# EAGLE design powerSupply (EAGLE 7.0.0)
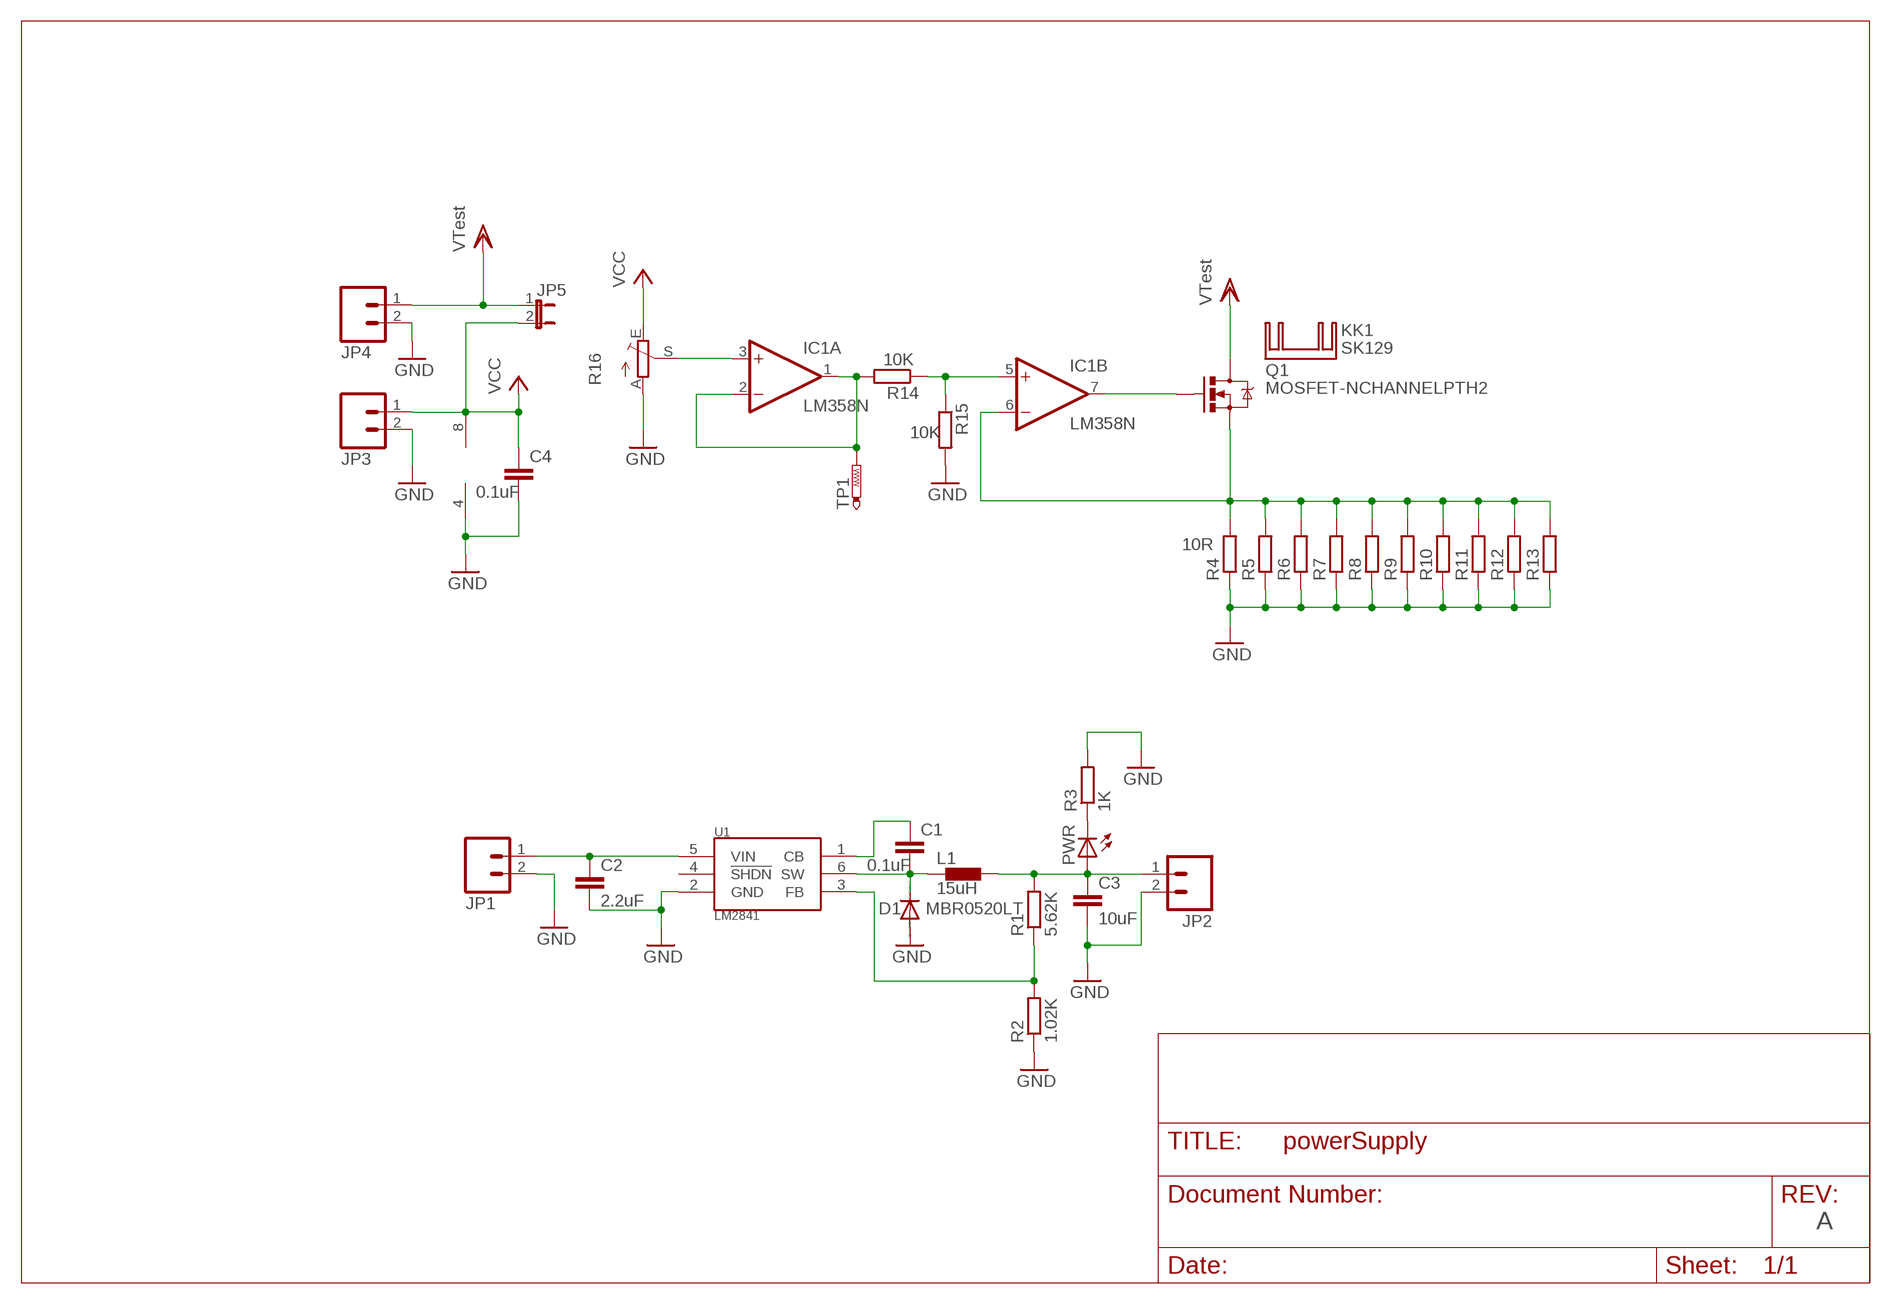
[diagram p0: schematic, sheet 1]

## Parts
C1  0.1uF  C-EUC0805  [C0805]
C2  2.2uF  C-EUC1206  [C1206]
C3  10uF  C-EUC1206  [C1206]
C4  0.1uF  C-EUC0805  [C0805]
D1  MBR0520LT  [SOD123]
IC1  LM358N  [DIL08]
JP1  M02PTH  [1X02]
JP2  M02PTH  [1X02]
JP3  M02PTH  [1X02]
JP4  M02PTH  [1X02]
JP5  JUMPER-2PTH  [1X02]
KK1  SK129  [SK129-HOLE]
L1  15uH  LQHXXSNLQH55DN  [LQH]
PWR  LEDCHIPLED_0805  [CHIPLED_0805]
Q1  MOSFET-NCHANNELPTH2  [TO220V]
R1  5.62K  R-EU_M0805  [M0805]
R2  1.02K  R-EU_M0805  [M0805]
R3  1K  R-EU_M0805  [M0805]
R4  10R  R-EU_M0805  [M0805]
R5  R-EU_M0805  [M0805]
R6  R-EU_M0805  [M0805]
R7  R-EU_M0805  [M0805]
R8  R-EU_M0805  [M0805]
R9  R-EU_M0805  [M0805]
R10  R-EU_M0805  [M0805]
R11  R-EU_M0805  [M0805]
R12  R-EU_M0805  [M0805]
R13  R-EU_M0805  [M0805]
R14  10K  R-EU_M0805  [M0805]
R15  10K  R-EU_M0805  [M0805]
R16  TRIM_EU-B64Y  [B64Y]
TP1  PTR1TP20R  [TP20R]
U1  LM2841  [TSOT6]

## Nets
GND: C2.2 C3.2 C4.2 D1.A IC1.4(P:V-) JP1.2 JP2.2 JP3.2 JP4.2 R2.1 R3.2 R4.1 R5.1 R6.1 R7.1 R8.1 R9.1 R10.1 R11.1 R12.1 R13.1 R15.2 R16.A U1.2(GND)
N$1: C1.2 D1.C L1.1 U1.6(SW)
N$2: C1.1 U1.1(CB)
N$3: C3.1 JP2.1 L1.2 PWR.A R1.2
N$4: R1.1 R2.2 U1.3(FB)
N$5: PWR.C R3.1
N$6: C2.1 JP1.1 U1.5(VIN)
N$7: IC1.7(B:OUT) Q1.1(G)
N$9: IC1.5(B:+IN) R14.1 R15.1
N$10: IC1.1(A:OUT) IC1.2(A:-IN) R14.2 TP1.TP
N$11: IC1.3(A:+IN) R16.S
N$19: IC1.6(B:-IN) Q1.3(S) R4.2 R5.2 R6.2 R7.2 R8.2 R9.2 R10.2 R11.2 R12.2 R13.2
VCC: C4.1 IC1.8(P:V+) JP3.1 JP5.2 R16.E
VDD: JP4.1 JP5.1 Q1.2(D) ; supply symbol labelled VTest
Unconnected: U1.4(!SHDN)

## Notes on the sheet
- A

## Library data of the parts
C1-C4 = rcl:C-EU: CAPACITOR, European symbol
D1 = diode:MBR0520LT: SCHOTTKY BARRIER RECTIFIER Source: http://onsemi.com .. MBR0520LT1-D.pdf
IC1 = linear:LM358: OP AMP also LM158; LM258; LM2904 Source: http://cache.national.com/ds/LM/LM158.pdf
JP1-JP4 = SparkFun:M02: Header 2 Standard 2-pin 0.1" header. Use with straight break away headers (SKU : PRT-00116), right angle break away headers (PRT-00553), swiss pins (PRT-00743), machine pins (PRT-00117), and female headers (PRT-00115). Molex polarized connector foot print use with SKU : PRT-08233 with associated crimp pins and housings.
JP5 = SparkFun:JUMPER-2: Jumper Basic 0.1" spaced jumper. Use with breakaway headers.
KK1 = heatsink:SK129: HEATSINK manufacturer Fischer/distributor Buerklin
L1 = inductors:LQHXXSN
PWR = led:LED: LED OSRAM: - CHIPLED LG R971, LG N971, LY N971, LG Q971, LY Q971, LO R971, LY R971 LH N974, LH R974 LS Q976, LO Q976, LY Q976 LO Q996 - Hyper CHIPLED LW Q18S LB Q993, LB Q99A, LB R99A - SideLED LS A670, LO A670, LY A670, LG A670, LP A670 LB A673, LV A673, LT A673, LW A673 LH A674 LY A675 LS A676, LA A676, LO A676, LY A676, LW A676 LS A679, LY A679, LG A679 - Hyper Micro SIDELED® LS Y876, LA Y876, LO Y876, LY Y876 LT Y87S - SmartLED LW L88C, LW L88S LB L89C, LB L89S, LG L890 LS L89K, LO L89K, LY L89K LS L896, LA L896, LO L896, LY L896 - TOPLED LS T670, LO T670, LY T670, LG T670, LP T670 LSG T670, LSP T670, LSY T670, LOP T670, LYG T670 LG T671, LOG T671, LSG T671 LB T673, LV T673, LT T673, LW T673 LH T674 LS T676, LA T676, LO T676, LY T676, LB T676, LH T676, LSB T676, LW T676 LB T67C, LV T67C, LT T67C, LS T67K, LO T67K, LY T67K, LW E67C LS E67B, LA E67B, LO E67B, LY E67B, LB E67C, LV E67C, LT E67C LW T67C LS T679, LY T679, LG T679 LS T770, LO T770, LY T770, LG T770, LP T770 LB T773, LV T773, LT T773, LW T773 LH T774 LS E675, LA E675, LY E675, LS T675 LS T776, LA T776, LO T776, LY T776, LB T776 LHGB T686 LT T68C, LB T68C - Hyper Mini TOPLED® LB M676 - Mini TOPLED Santana® LG M470 LS M47K, LO M47K, LY M47K Source: http://www.osram.convergy.de LUXEON: - LUMILED® LXK2-PW12-R00, LXK2-PW12-S00, LXK2-PW14-U00, LXK2-PW14-V00 LXK2-PM12-R00, LXK2-PM12-S00, LXK2-PM14-U00 LXK2-PE12-Q00, LXK2-PE12-R00, LXK2-PE12-S00, LXK2-PE14-T00, LXK2-PE14-U00 LXK2-PB12-K00, LXK2-PB12-L00, LXK2-PB12-M00, LXK2-PB14-N00, LXK2-PB14-P00, LXK2-PB14-Q00 LXK2-PR12-L00, LXK2-PR12-M00, LXK2-PR14-Q00, LXK2-PR14-R00 LXK2-PD12-Q00, LXK2-PD12-R00, LXK2-PD12-S00 LXK2-PH12-R00, LXK2-PH12-S00 LXK2-PL12-P00, LXK2-PL12-Q00, LXK2-PL12-R00 Source: www.luxeon.com KINGBRIGHT: KA-3528ASYC Source: www.kingbright.com
Q1 = SparkFun:MOSFET-NCHANNEL
R1-R3 = rcl:R-EU_: RESISTOR, European symbol
R4-R15 = resistor:R-EU_: RESISTOR, European symbol
R16 = pot:TRIM_EU-: POTENTIOMETER
TP1 = testpad:PTR1: TEST PIN
U1 = fmcVarious:LM2841

## Board
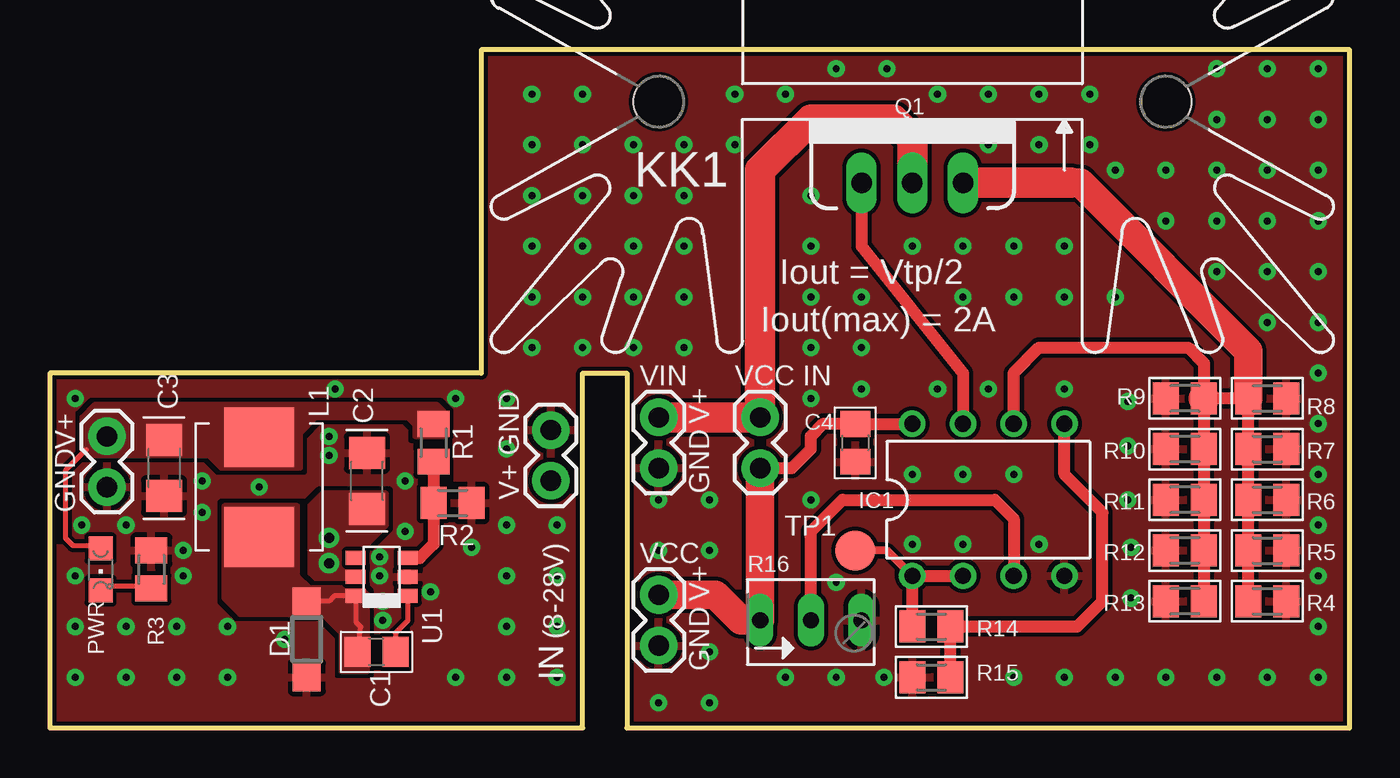
[diagram p1: board, top side]
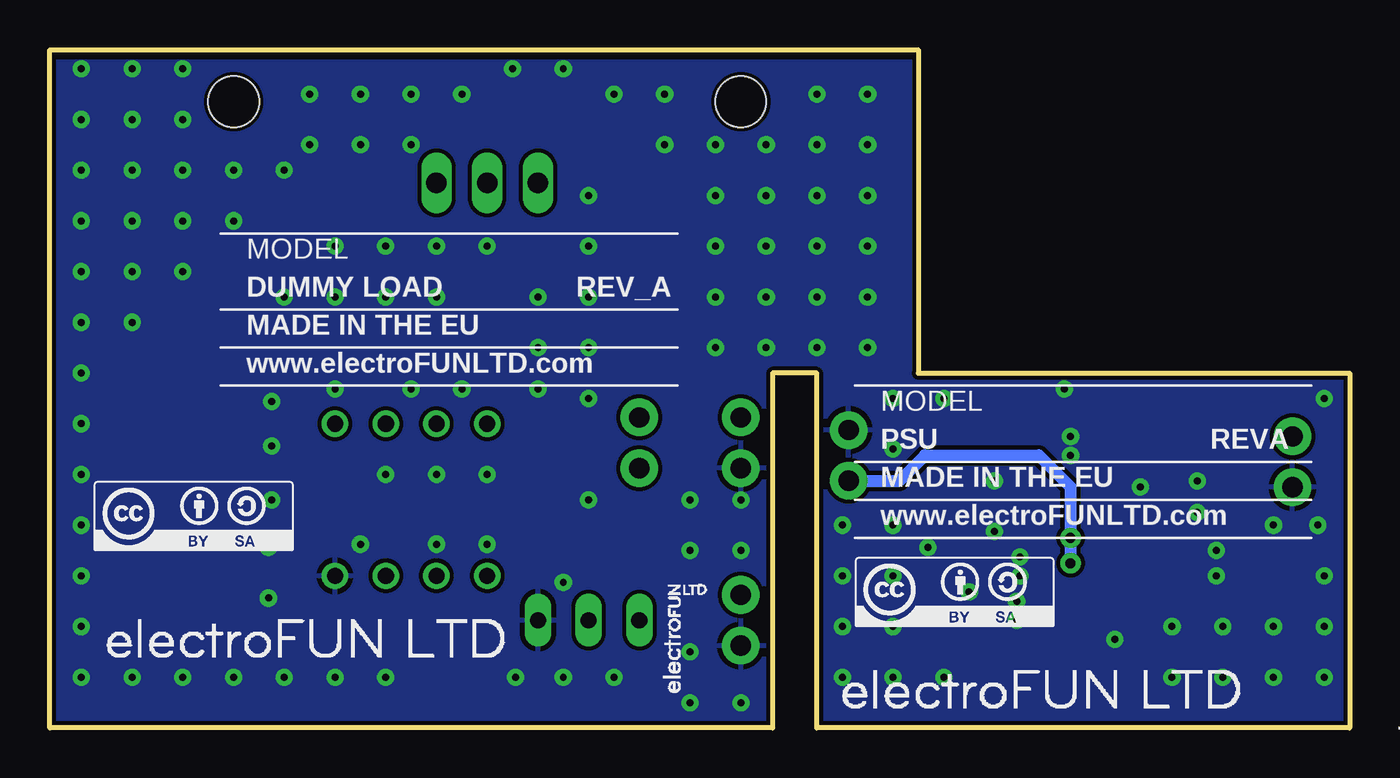
[diagram p2: board, bottom side, seen from below]

Size 65.08 x 33.96 mm. Coordinates in mm from the lower left corner, seen from the top.
Outline: 0,0 26.67,0 26.67,17.78 28.89,17.78 28.89,0 65.08,0 65.08,33.96 21.59,33.96 21.59,17.78 0,17.78 0,0
Copper layers (1*16): Top 0.035mm / dielectric 1.5mm / Bottom 0.035mm
Design rules "SparkFun-2-layer *": minimum track width 7mil, minimum drill 0.3mm, track to track 8mil, track to pad 8mil, pad to pad 8mil, via to via 8mil, smd to smd 8mil, copper to edge 8mil, drill to drill 8mil, minimum pad ring 10mil, minimum via ring 10mil, stop-mask expansion 4mil, vias tented up to drill 20mil, thermal gap 10mil

### Footprints (pad centres in the part's own frame; a part is rotated, then mirrored left to right if it is on the bottom)
C0805 = smd 1.3 x 1.5: 1 -0.95,0; 2 0.95,0
C1206 = smd 1.6 x 1.8: 1 -1.4,0; 2 1.4,0
SOD123 = smd 1.4 x 1.4: A 1.9,0; C -1.9,0
DIL08 = drill 0.813 pad 1.27: 1 -3.81,-3.81; 2 -1.27,-3.81; 3 1.27,-3.81; 4 3.81,-3.81; 5 3.81,3.81; 6 1.27,3.81; 7 -1.27,3.81; 8 -3.81,3.81
1X02 = drill 1.016 pad 1.88: 1 0,0; 2 2.54,0
SK129-HOLE = hole 2.54: -12.7,-0.889; 12.7,-0.889
LQH = smd 3 x 3.5: 1 -2.5,0; 2 2.5,0
CHIPLED_0805 = smd 1.2 x 1.2: A 0,-1.05; C 0,1.05
TO220V = drill 1.016 long: 1 -2.54,0; 2 0,0; 3 2.54,0
M0805 = smd 1.3 x 1.6: 1 -0.95,0; 2 0.95,0
B64Y = drill 0.813 long: A 2.54,0; E -2.54,0; S 0,0
TP20R = smd 2 x 2: TP 0,0
TSOT6 = smd 0.69 x 1: 1 -1,-1.4; 2 -0.05,-1.4; 3 0.9,-1.4; 4 0.9,1.2; 5 -0.05,1.2; 6 -1,1.2

### Placement (x,y rotation side)
C1  16.35,3.81 180 top
C2  15.88,12.38 90 top
C3  5.71,13.02 270 top
C4  40.32,14.29 270 top
D1  12.86,4.45 270 top
IC1  46.99,11.43 0 top
JP1  25.08,12.38 90 top
JP2  2.86,14.61 270 top
JP3  30.48,6.67 270 top
JP4  30.48,15.56 270 top
JP5  35.56,15.56 270 top
KK1  43.18,30.48 180 top
L1  10.48,12.06 90 top
PWR  2.54,7.94 180 top
Q1  43.18,27.3 0 top
R1  19.21,14.29 90 top
R2  20.16,11.27 180 top
R3  5.08,7.94 90 top
R4  60.96,6.35 180 top
R5  60.96,8.89 180 top
R6  60.96,11.43 180 top
R7  60.96,13.97 180 top
R8  60.96,16.51 180 top
R9  56.83,16.51 0 top
R10  56.83,13.97 0 top
R11  56.83,11.43 0 top
R12  56.83,8.89 0 top
R13  56.83,6.35 0 top
R14  44.13,5.08 180 top
R15  44.13,2.54 180 top
R16  38.1,5.4 0 top
REV_A  DUMMY LOAD  [BOARD_INFO_LARGE]  45.09,18.41 0 bottom
REVA  PSU  [BOARD_INFO_LARGE]  13.34,10.79 0 bottom
TP1  40.32,8.89 0 top
U1  16.51,7.62 90 top
U$1  [ELECTROFUN_STRIP]  30.8,-1.27 0 bottom
U$2  [SA-BY]  24.77,5.08 0 bottom
U$3  [ELECTROFUN_STRIP]  67.63,1.27 0 bottom
U$4  [SA-BY]  62.87,8.89 0 bottom

### Tracks (layer width: path | path; a pad name or v marks a point on that pad's centre or on a via)
GND  (via drill 0.35)
  other vias: 16.67,5.4 16.67,6.35 16.51,8.57 17.78,9.84 16.51,7.62 21.11,9.05 22.86,10.16 22.86,7.62 22.86,5.08 22.86,2.54 20.32,2.54 25.4,2.54 25.4,5.08 25.4,7.62 25.4,10.16 22.86,13.97 22.86,16.51 20.32,16.51 14.29,16.99 1.27,16.51 1.59,10.16 1.27,7.62 1.27,5.08 1.27,2.54 3.81,2.54 3.81,5.08 3.81,10.16 6.67,8.89 6.67,7.62 6.35,5.08 6.35,2.54 8.89,2.54 8.89,5.08 11.75,4.45 7.62,12.38 7.62,10.79 10.48,12.06 13.97,13.65 13.97,14.61 17.78,12.38 24.13,31.75 24.13,29.21 24.13,26.67 24.13,24.13 24.13,21.59 24.13,19.05 26.67,19.05 26.67,21.59 26.67,24.13 26.67,26.67 26.67,29.21 26.67,31.75 29.21,19.05 31.75,19.05 29.21,21.59 31.75,21.59 31.75,24.13 29.21,24.13 29.21,26.67 31.75,26.67 31.75,29.21 29.21,29.21 34.29,29.21 34.29,31.75 36.83,31.75 38.1,24.13 38.1,21.59 38.1,19.05 38.1,16.51 38.1,26.67 40.64,21.59 40.64,19.05 43.18,24.13 45.72,24.13 48.26,24.13 50.8,24.13 50.8,21.59 48.26,21.59 45.72,21.59 53.34,21.59 48.26,12.7 45.72,12.7 43.18,12.7 38.1,11.43 39.37,7.3 43.18,9.21 45.72,9.21 49.53,9.21 33.02,11.43 33.02,8.89 30.48,8.89 30.48,11.43 33.02,3.81 36.83,2.54 39.37,2.54 41.75,2.54 48.26,2.54 50.8,2.54 53.34,2.54 55.88,2.54 58.42,2.54 60.96,2.54 63.5,2.54 63.5,5.08 63.5,7.62 63.5,10.16 63.5,12.7 63.5,15.24 63.5,17.78 63.5,20.32 63.5,22.86 63.5,25.4 63.5,27.94 63.5,30.48 53.98,16.35 53.98,14.13 30.48,1.27 33.02,1.27 60.96,27.94 58.42,27.94 55.88,27.94 53.34,27.94 55.88,25.4 58.42,25.4 60.96,25.4 60.96,22.86 58.42,22.86 60.96,20.32 44.45,31.75 46.99,31.75 49.53,31.75 52.07,31.75 46.99,29.21 49.53,29.21 52.07,29.21 60.96,30.48 58.42,30.48 39.37,33.02 41.91,33.02 58.42,33.02 60.96,33.02 63.5,33.02 53.98,11.43 54.13,9.05 54.13,6.51 19.05,6.83 40.64,16.99 44.45,16.99 46.99,16.99 50.8,16.99
  pour Top (rank 3): 0,0 0,52.07 64.77,52.07 64.77,0
  pour Bottom: -0.32,0 -0.32,33.34 65.09,33.34 65.09,0.32 26.67,0
N$1
  Top 0.254: C1.2 15.56,5.08 15.31,5.33 U1.6 14.24,6.62 13.97,6.35 12.71,6.35 D1.C
  pour Top (no thermals): 15.88,2.86 15.88,6.67 15.56,6.99 13.02,6.99 12.38,7.62 12.38,11.11 8.73,11.11 8.73,6.51 9.53,5.71 13.65,5.71 14.61,4.76 14.61,2.86
N$2
  Top 0.254: U1.1 17.91,5.37 17.3,4.76 17.3,3.65 C1.1
N$3
  Top 0.254: 1.83,13.95 0.78,12.89 0.78,9.51 1.14,9.14 2.52,9.14 PWR.A
  pour Top (no thermals): 19.84,14.61 19.84,15.74 19.39,16.19 2.22,16.19 1.59,15.56 1.59,13.97 1.91,13.65 7.94,13.65 8.57,13.02 12.54,13.02 12.54,14.76 13.34,15.56 17.9,15.56 18.26,15.2 18.26,14.61
N$4
  Top 0.305: R2.2
  Top 0.61: R1.1 R2.2 | U1.3 18.52,8.52 19.21,9.21 R2.2
N$5
  Top 0.254: PWR.C 2.74,7.09 5.03,7.09 R3.1
N$6  (via drill 0.5)
  Bottom 0.61: JP1.1 22.54,12.38 21.27,13.65 15.56,13.65 13.97,12.06 v13.97,9.53 v13.97,8.26
  pour Top (rank 2, no thermals): 13.02,11.11 13.02,7.62 13.34,7.3 15.56,7.3 15.56,8.89 16.83,10.16 16.83,11.75 13.65,11.75
N$7
  Top 0.61: Q1.1 40.64,24.13 45.72,17.78 IC1.7
N$9
  Top 0.61: R15.1 R14.1 51.44,5.08 52.7,6.35 52.7,10.79 50.8,12.7 IC1.5
N$10
  Top 0.406: TP1.TP 41.91,8.89 IC1.1
  Top 0.61: R14.2 IC1.1 IC1.2
N$11
  Top 0.61: R16.S 38.1,9.84 39.69,11.43 47.31,11.43 48.26,10.48 IC1.3
N$19
  Top 0.61: R4.2 R5.2 R6.2 R7.2 R8.2 R9.2 R10.2 R11.2 R12.2 R13.2 | IC1.6 48.26,17.78 49.53,19.05 56.99,19.05 57.78,18.26 R9.2
  Top 1.422: 51.12,27.3 51.59,27.3 60.01,18.89 R8.2
  Top 1.524: Q1.3 51.12,27.3 | R9.2
VCC
  Top 0.61: JP5.2 37.15,13.02 38.1,13.97 38.1,14.61 38.73,15.24 C4.1 IC1.8
  Top 1.422: JP3.1 33.34,6.67 34.61,5.4 R16.E JP5.2
VDD
  Top 1.524: JP4.1 JP5.1 35.56,27.94 38.1,30.48 42.23,30.48 43.18,29.53 Q1.2

### Text on the board
tPlace: Iout = Vtp/2 | Iout(max) = 2A | VIN | VCC IN | V+ | V+ | GND | GND | GND | V+ | VCC | V+ | (8-28V) | GND | IN